# Altium schematic sheet Environmental.SchDoc: SealHAT: Environmental Subsystem
size Letter
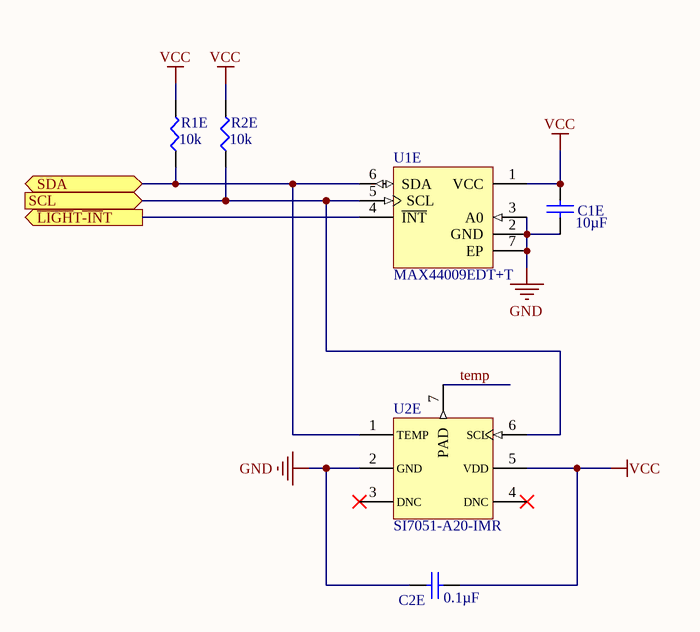
[diagram p0: Environmental.SchDoc]

## Parts
C1E  Capacitance: 10µF  [C0603N]  (hidden comment: GRT188R61C106KE13D)
C2E  Capacitance: 0.1µF  [C0603N]  (hidden comment: GCM188R71C104KA37D)
R1E  value 10k  [SMD-0603-RES]  (hidden comment: ERJ-3EKF1002V)
R2E  value 10k  [SMD-0603-RES]  (hidden comment: ERJ-3EKF1002V)
U1E  MAX44009EDT+T  [21-0490D]
U2E  SI7051-A20-IMR  [si705x-hand]

## Ports
SCL (in), SDA (bidir), ~{LIGH}T~{-IN}T (out)

## Nets
GND: C1E.1 C2E.1 U1E.2(GND) U1E.3(A0) U1E.7(EP) U2E.2(GND)
VCC: C1E.2 C2E.2 R1E.2 R2E.2 U1E.1(VCC) U2E.5(VDD)
~{LIGH}T~{-IN}T: U1E.4(~{INT}) ; port ~{LIGH}T~{-IN}T
SCL: R2E.1 U1E.5(SCL) U2E.6(SCL) ; port SCL
SDA: R1E.1 U1E.6(SDA) U2E.1(TEMP) ; port SDA
temp: U2E.7(PAD)

Not connected (* = marked no-connect by the designer): U2E 3(DNC)* 4(DNC)*

## Notes on the sheet
- Title
- Size:
- Date:
- Letter
- Number:
- Time:
- Revision:
- Sheet
- of
- File:

## Library data of the parts
C1E = CAPACITOR_NP: 10µF 16V Ceramic Capacitor X5R 0603; HOUSEPART: NO; POPULATE: 1; TOLERANCE: ±10%; VOLTAGE: 10V; DeviceName: GRT188R61C106KE13D; LibraryName: MF_Passives; DeviceSetName: CAPACITOR_NP; MPN: GRT188R61C106KE13D; MF_PARTNUM: GRT188R61C106KE13D; Supplier 1: Digi-Key; Supplier Part Number 1: 490-12317-1-ND
C2E = CAPACITOR_NP: HOUSEPART: NO; POPULATE: 1; TOLERANCE: ±10%; VOLTAGE: 16V; Temperature Coefficient: X7R; DeviceName: GCM188R71C104KA37D; LibraryName: MF_Passives; DeviceSetName: CAPACITOR_NP; MPN: GCM188R71C104KA37D; MF_PARTNUM: GCM188R71C104KA37D; Supplier 1: Digi-Key; Supplier Part Number 1: 490-4774-1-ND
R1E R2E = ERJ-3EKF1002V: RES SMD 10K OHM 1% 1/10W 0603; Manufacturer: Panasonic Electronic Components; Factory Stock: 0; Unit Price (USD): 0.00379; @ qty: 1500; Minimum Quantity: 1; Power (Watts): 0.1W, 1/10W; Temperature Coefficient: ±100ppm/°C; Part Number: ERJ-3EKF1002V; Datasheets: http://industrial.panasonic.com/www-cgi/jvcr13pz.cgi?E+PZ+3+AOA0002+ERJ3EKF1002V+7+WW; Image: //media.digikey.com/Photos/Panasonic%20Photos/MFG_ERJ-P6W%20Series.jpg; Digi-Key Part Number: P10.0KHCT-ND; Quantity Available: 6703141; Packaging: Cut Tape (CT); Series: ERJ; Part Status: Active; Tolerance: ±1%; Composition: Thick Film; Features: Automotive AEC-Q200; Operating Temperature: -55°C ~ 155°C; Package / Case: 0603 (1608 Metric); Supplier Device Package: 0603; Size / Dimension: 0.063" L x 0.031" W (1.60mm x 0.80mm); Height - Seated (Max): 0.022" (0.55mm); Number of Terminations: 2; Failure Rate: -; Supplier 1: Digi-Key; Supplier Part Number 1: P10.0KHCT-ND
U1E = MAX44009EDT+T: MAX44009 light sensor; Octopart Url: https://octopart.com/max44009edt%2Bt-maxim+integrated-44380498; Manufacturer Part Number: MAX44009EDT+T; Lifecycle Status: Active; OctopartID: e71f2cb0f32b38d8; Case/Package: 6-UDFN; Supplier 1: Digi-Key; Supplier Part Number 1: MAX44009EDT+TCT-ND
U2E = CMP-6e6fa3261226b1a8-2: Temperature Sensor tal, Local -40°C ~ 125°C 14 b 6-DFN (3x3); Octopart URL: https://octopart.com/si7051-a20-im-silicon+labs-71522607; RoHS: Compliant; Case/Package: 6-DFN; Manufacturer Part Number: SI7051-A20-IMR; Supplier 1: Digi-Key; Supplier Part Number 1: 336-4764-1-ND